# Altium schematic sheet LED Connection.SchDoc
size 420 x 297 mm; Address1: Address1; Address2: Address2; Address3: Address3; Address4: Address4; DocumentNumber: StairsLED; SheetNumber: 3; Scale: 1:1; DocumentType: Схема электрическая принципиальная; FirstReferrence: StaitsLED
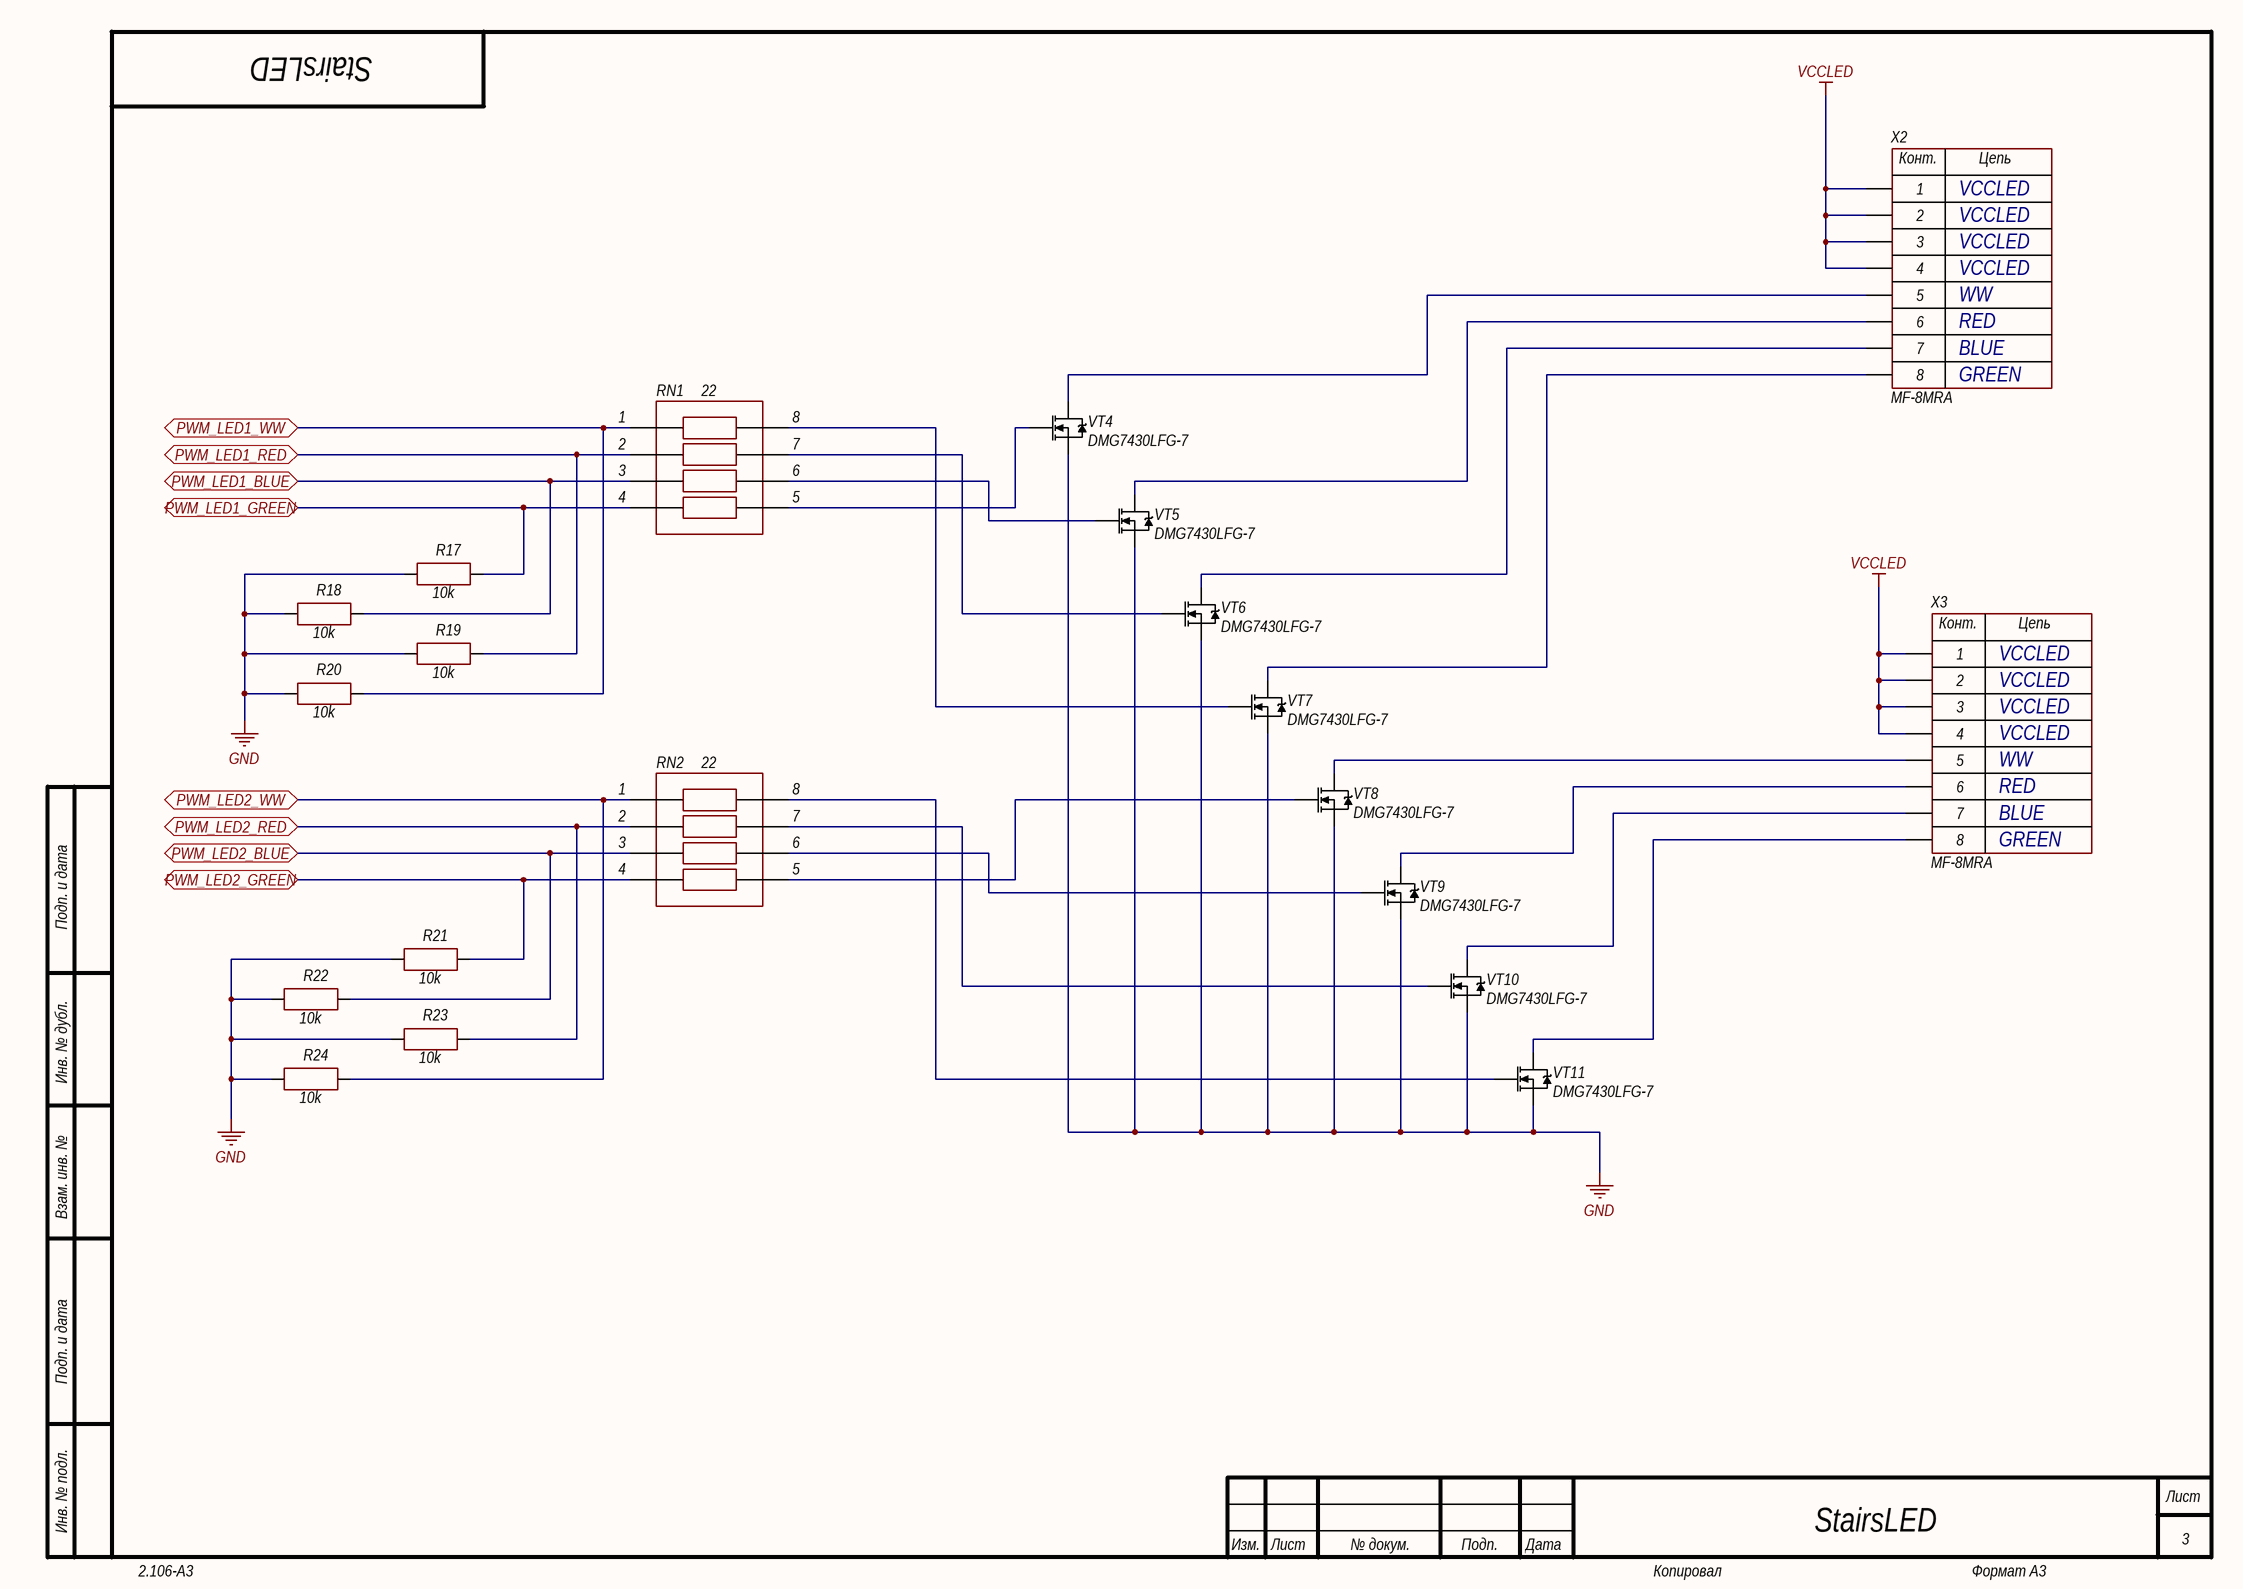
[diagram p0: LED Connection.SchDoc]

## Parts
R17  10k  [CH0603R]
R18  10k  [CH0603R]
R19  10k  [CH0603R]
R20  10k  [CH0603R]
R21  10k  [CH0603R]
R22  10k  [CH0603R]
R23  10k  [CH0603R]
R24  10k  [CH0603R]
RN1  22  [CH0603Rx4 (1206)]
RN2  22  [CH0603Rx4 (1206)]
VT4  DMG7430LFG-7  [TRANS: PowerDI®3333-8]
VT5  DMG7430LFG-7  [TRANS: PowerDI®3333-8]
VT6  DMG7430LFG-7  [TRANS: PowerDI®3333-8]
VT7  DMG7430LFG-7  [TRANS: PowerDI®3333-8]
VT8  DMG7430LFG-7  [TRANS: PowerDI®3333-8]
VT9  DMG7430LFG-7  [TRANS: PowerDI®3333-8]
VT10  DMG7430LFG-7  [TRANS: PowerDI®3333-8]
VT11  DMG7430LFG-7  [TRANS: PowerDI®3333-8]
X2  MF-8MRA  [CON: MF-8MRA]
X3  MF-8MRA  [CON: MF-8MRA]

## Ports
PWM_LED1_BLUE (bidir), PWM_LED1_GREEN (bidir), PWM_LED1_RED (bidir), PWM_LED1_WW (bidir), PWM_LED2_BLUE (bidir), PWM_LED2_GREEN (bidir), PWM_LED2_RED (bidir), PWM_LED2_WW (bidir)

## Nets
GND: R17.1 R18.1 R19.1 R20.1 R21.1 R22.1 R23.1 R24.1 VT4.3(S) VT5.3(S) VT6.3(S) VT7.3(S) VT8.3(S) VT9.3(S) VT10.3(S) VT11.3(S)
VCCLED: X2.1 X2.2 X2.3 X2.4 X3.1 X3.2 X3.3 X3.4
PWM_LED1_BLUE: R18.2 RN1.3 ; port PWM_LED1_BLUE
PWM_LED1_GREEN: R17.2 RN1.4 ; port PWM_LED1_GREEN
PWM_LED1_RED: R19.2 RN1.2 ; port PWM_LED1_RED
PWM_LED1_WW: R20.2 RN1.1 ; port PWM_LED1_WW
PWM_LED2_BLUE: R22.2 RN2.3 ; port PWM_LED2_BLUE
PWM_LED2_GREEN: R21.2 RN2.4 ; port PWM_LED2_GREEN
PWM_LED2_RED: R23.2 RN2.2 ; port PWM_LED2_RED
PWM_LED2_WW: R24.2 RN2.1 ; port PWM_LED2_WW
NetRN1_5: RN1.5 VT4.1(G)
NetRN1_6: RN1.6 VT5.1(G)
NetRN1_7: RN1.7 VT6.1(G)
NetRN1_8: RN1.8 VT7.1(G)
NetRN2_5: RN2.5 VT8.1(G)
NetRN2_6: RN2.6 VT9.1(G)
NetRN2_7: RN2.7 VT10.1(G)
NetRN2_8: RN2.8 VT11.1(G)
NetVT4_2: VT4.2(D) X2.5
NetVT5_2: VT5.2(D) X2.6
NetVT6_2: VT6.2(D) X2.7
NetVT7_2: VT7.2(D) X2.8
NetVT8_2: VT8.2(D) X3.5
NetVT9_2: VT9.2(D) X3.6
NetVT10_2: VT10.2(D) X3.7
NetVT11_2: VT11.2(D) X3.8

## Notes on the sheet
- VCCLED
- WW
- RED
- BLUE
- GREEN
- Подп. и дата
- Инв. № дубл.
- Взам. инв. №
- Инв. № подл.
- Изм.
- Лист
- № докум.
- Подп.
- Дата
- 2.106-A3
- Копировал
- Формат А3
- (in symbol 8-Connector) Конт.; Цепь

## Library data of the parts
R17-R24 = Resistor: Manufacturer: *; Model: *; HelpURL: *; ComponentKind: *; Value: 10k
RN1 RN2 = Resistor assembly: Manufacturer: Bourns GmbH.; Model: CAT16-J4; HelpURL: https://www.terraelectronica.ru/pdf/show?pdf_file=https%253A%252F%252Fwww.mouser.com%252Fds%252F2%252F54%252FATCAY-777361.pdf; ComponentKind: *; Value: 22
VT4-VT11 = N-chanel: Mosfet; Manufacturer: Diodes Incorporated; Model: DMG7430LFG-7; ComponentKind: 30V, 10A; HelpURL: https://www.diodes.com/assets/Datasheets/DMG7430LFG.pdf
X2 X3 = 8-Connector: Model: MF-8MRA; Manufacturer: *; HelpURL: *; ComponentKind: *